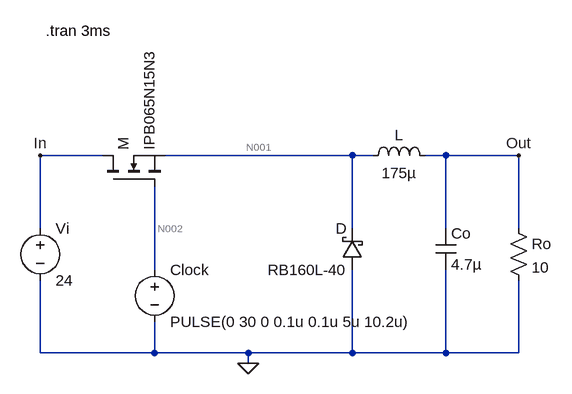
[diagram p0: schematic Buck Converter.asc]
Buck Converter.asc, the LTspice schematic file:
Version 4
SHEET 1 880 680
WIRE -288 -64 -384 -64
WIRE 96 -64 -192 -64
WIRE 128 -64 96 -64
WIRE 240 -64 208 -64
WIRE 352 -64 240 -64
WIRE -384 48 -384 -64
WIRE 96 48 96 -64
WIRE 240 48 240 -64
WIRE 352 48 352 -64
WIRE -208 112 -208 -16
WIRE -384 240 -384 128
WIRE -208 240 -208 192
WIRE -208 240 -384 240
WIRE -64 240 -208 240
WIRE 96 240 96 112
WIRE 96 240 -64 240
WIRE 240 240 240 112
WIRE 240 240 96 240
WIRE 352 240 352 128
WIRE 352 240 240 240
WIRE -64 256 -64 240
FLAG -64 256 0
FLAG 352 -64 Out
FLAG -384 -64 In
SYMBOL nmos -288 -16 R270
SYMATTR InstName M
SYMATTR Value IPB065N15N3
SYMBOL ind 112 -48 R270
WINDOW 0 32 56 VTop 2
WINDOW 3 5 56 VBottom 2
SYMATTR InstName L
SYMATTR Value 175µ
SYMBOL schottky 112 112 R180
WINDOW 0 24 64 Left 2
WINDOW 3 24 0 Left 2
SYMATTR InstName D
SYMATTR Value RB160L-40
SYMATTR Description Diode
SYMATTR Type diode
SYMBOL cap 224 48 R0
SYMATTR InstName Co
SYMATTR Value 4.7µ
SYMBOL res 336 32 R0
SYMATTR InstName Ro
SYMATTR Value 10
SYMBOL voltage -208 96 R0
WINDOW 123 0 0 Left 2
WINDOW 39 0 0 Left 2
SYMATTR InstName Clock
SYMATTR Value PULSE(0 30 0 0.1u 0.1u 5u 10.2u)
SYMBOL voltage -384 32 R0
WINDOW 123 0 0 Left 2
WINDOW 39 0 0 Left 2
SYMATTR InstName Vi
SYMATTR Value 24
TEXT -376 -256 Left 2 !.tran 3ms

The netlist it stands for:
* Buck Converter.asc
M In N002 N001 N001 IPB065N15N3
L N001 Out 175µ
D 0 N001 RB160L-40
Co Out 0 4.7µ
Ro Out 0 10
V§Clock N002 0 PULSE(0 30 0 0.1u 0.1u 5u 10.2u)
Vi In 0 24
.model D D
.lib standard.dio
.model NMOS NMOS
.model PMOS PMOS
.lib standard.mos
.tran 3ms
.backanno
.end

* Results of the author's LTspice run, read from the files saved beside the schematic
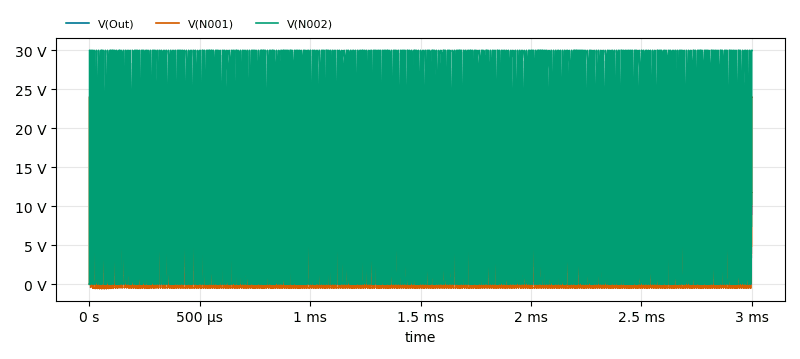
[diagram p1: Transient Analysis of Buck Converter.asc, plotted from the saved traces]
* Transient Analysis, 1 run:
*   V(Out): min 0 V, max 16.07 V, average 11.7 V, rms 11.76 V, last 11.73 V
*   V(N001): min -587.3 mV, max 24.01 V, average 11.77 V, rms 16.92 V, last 23.99 V
*   V(N002): min 0 V, max 30 V, average 15.01 V, rms 21.15 V, last 30 V